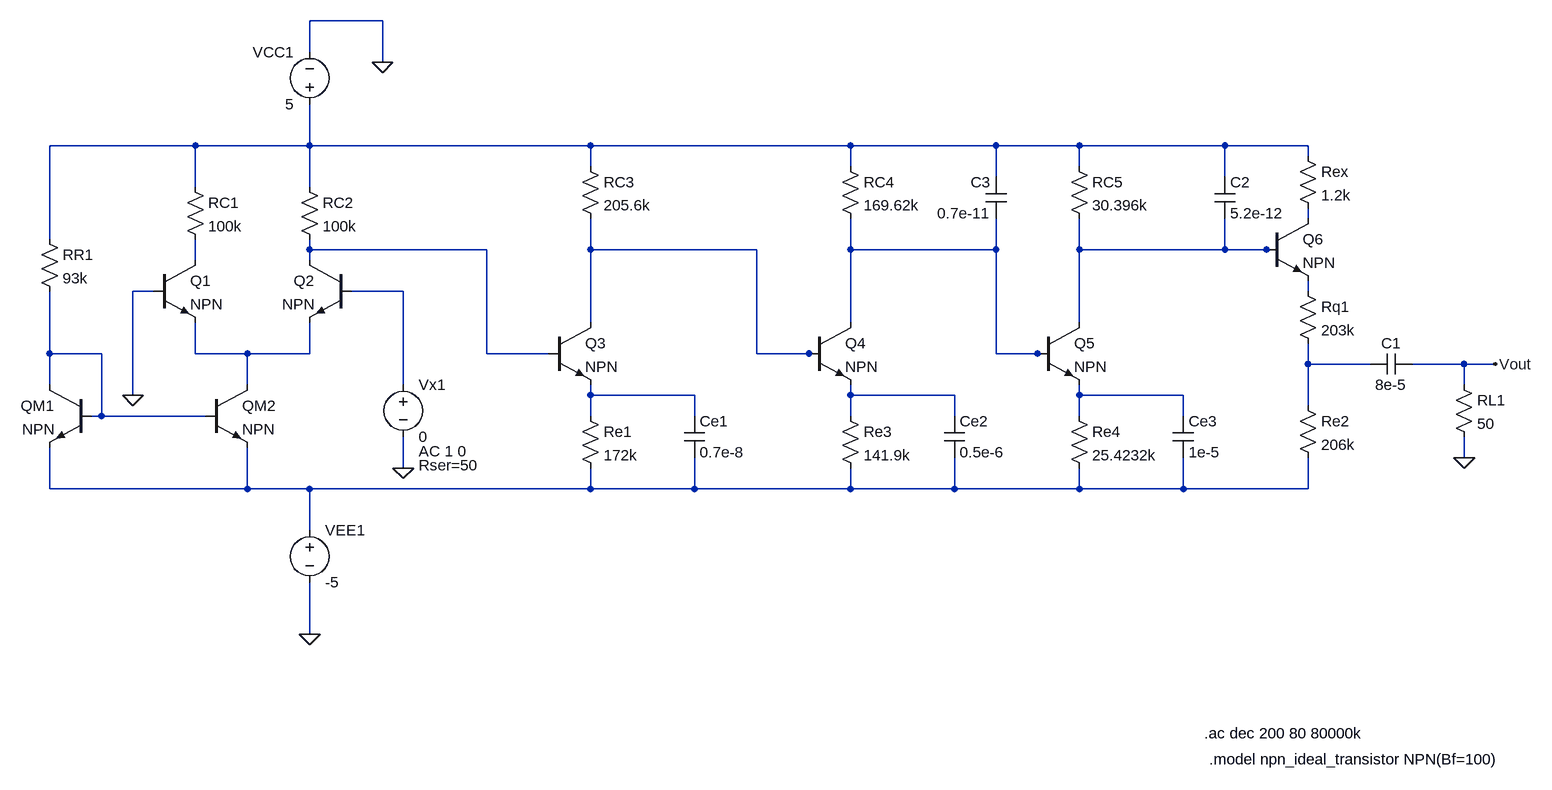
[diagram p0: schematic Frequency Response.asc]
Frequency Response.asc, the LTspice schematic file:
Version 4
SHEET 1 2228 1088
WIRE 448 -64 336 -64
WIRE 336 -16 336 -64
WIRE 448 0 448 -64
WIRE 160 128 -64 128
WIRE 336 128 336 64
WIRE 336 128 160 128
WIRE 768 128 336 128
WIRE 1168 128 768 128
WIRE 1392 128 1168 128
WIRE 1520 128 1392 128
WIRE 1744 128 1520 128
WIRE 1872 128 1744 128
WIRE 1872 144 1872 128
WIRE 768 160 768 128
WIRE 1168 160 1168 128
WIRE 1520 160 1520 128
WIRE 1392 176 1392 128
WIRE 1744 176 1744 128
WIRE 160 192 160 128
WIRE 336 192 336 128
WIRE 1872 240 1872 224
WIRE -64 272 -64 128
WIRE 336 288 336 272
WIRE 608 288 336 288
WIRE 768 288 768 240
WIRE 1024 288 768 288
WIRE 1168 288 1168 240
WIRE 1392 288 1392 240
WIRE 1392 288 1168 288
WIRE 1520 288 1520 240
WIRE 1744 288 1744 240
WIRE 1744 288 1520 288
WIRE 1808 288 1744 288
WIRE 1824 288 1808 288
WIRE 160 304 160 272
WIRE 336 304 336 288
WIRE 96 352 64 352
WIRE 480 352 400 352
WIRE 1872 352 1872 336
WIRE 768 400 768 288
WIRE 1168 400 1168 288
WIRE 1520 400 1520 288
WIRE -64 448 -64 352
WIRE 16 448 -64 448
WIRE 160 448 160 400
WIRE 240 448 160 448
WIRE 336 448 336 400
WIRE 336 448 240 448
WIRE 608 448 608 288
WIRE 704 448 608 448
WIRE 1024 448 1024 288
WIRE 1104 448 1024 448
WIRE 1120 448 1104 448
WIRE 1392 448 1392 288
WIRE 1456 448 1392 448
WIRE 1472 448 1456 448
WIRE 1872 464 1872 432
WIRE 1968 464 1872 464
WIRE 2112 464 2032 464
WIRE 2160 464 2112 464
WIRE -64 496 -64 448
WIRE 240 496 240 448
WIRE 480 496 480 352
WIRE 2112 496 2112 464
WIRE 64 512 64 352
WIRE 768 512 768 496
WIRE 928 512 768 512
WIRE 1168 512 1168 496
WIRE 1328 512 1168 512
WIRE 1520 512 1520 496
WIRE 1680 512 1520 512
WIRE 1872 528 1872 464
WIRE 16 544 16 448
WIRE 16 544 0 544
WIRE 176 544 16 544
WIRE 768 544 768 512
WIRE 928 544 928 512
WIRE 1168 544 1168 512
WIRE 1328 544 1328 512
WIRE 1520 544 1520 512
WIRE 1680 544 1680 512
WIRE 2112 608 2112 576
WIRE 480 624 480 576
WIRE -64 656 -64 592
WIRE 240 656 240 592
WIRE 240 656 -64 656
WIRE 336 656 240 656
WIRE 768 656 768 624
WIRE 768 656 336 656
WIRE 928 656 928 608
WIRE 928 656 768 656
WIRE 1168 656 1168 624
WIRE 1168 656 928 656
WIRE 1328 656 1328 608
WIRE 1328 656 1168 656
WIRE 1520 656 1520 624
WIRE 1520 656 1328 656
WIRE 1680 656 1680 608
WIRE 1680 656 1520 656
WIRE 1872 656 1872 608
WIRE 1872 656 1680 656
WIRE 336 720 336 656
WIRE 336 880 336 800
FLAG 336 880 0
FLAG 448 0 0
FLAG 480 624 0
FLAG 2112 608 0
FLAG 2160 464 Vout
FLAG 64 512 0
SYMBOL res 144 176 R0
SYMATTR InstName RC1
SYMATTR Value 100k
SYMBOL res 320 176 R0
SYMATTR InstName RC2
SYMATTR Value 100k
SYMBOL Res 752 528 R0
SYMATTR InstName Re1
SYMATTR Value 172k
SYMBOL Res -80 256 R0
SYMATTR InstName RR1
SYMATTR Value 93k
SYMBOL Res 752 144 R0
SYMATTR InstName RC3
SYMATTR Value 205.6k
SYMBOL npn 96 304 R0
SYMATTR InstName Q1
SYMBOL npn 704 400 R0
SYMATTR InstName Q3
SYMBOL npn 176 496 R0
SYMATTR InstName QM2
SYMBOL npn 0 496 M0
SYMATTR InstName QM1
SYMBOL npn 400 304 M0
SYMATTR InstName Q2
SYMBOL voltage 336 704 R0
SYMATTR InstName VEE1
SYMATTR Value -5
SYMBOL voltage 336 80 R180
WINDOW 0 24 96 Left 2
WINDOW 3 24 16 Left 2
SYMATTR InstName VCC1
SYMATTR Value 5
SYMBOL voltage 480 480 R0
WINDOW 123 24 118 Left 2
WINDOW 39 24 140 Left 2
SYMATTR Value2 AC 1 0
SYMATTR SpiceLine Rser=50
SYMATTR InstName Vx1
SYMATTR Value 0
SYMBOL cap 912 544 R0
SYMATTR InstName Ce1
SYMATTR Value 0.7e-8
SYMBOL Res 1856 512 R0
SYMATTR InstName Re2
SYMATTR Value 206k
SYMBOL Res 2096 480 R0
SYMATTR InstName RL1
SYMATTR Value 50
SYMBOL cap 2032 448 R90
WINDOW 0 0 32 VBottom 2
WINDOW 3 32 32 VTop 2
SYMATTR InstName C1
SYMATTR Value 8e-5
SYMBOL Res 1152 528 R0
SYMATTR InstName Re3
SYMATTR Value 141.9k
SYMBOL Res 1152 144 R0
SYMATTR InstName RC4
SYMATTR Value 169.62k
SYMBOL npn 1104 400 R0
SYMATTR InstName Q4
SYMBOL cap 1312 544 R0
SYMATTR InstName Ce2
SYMATTR Value 0.5e-6
SYMBOL Res 1856 336 R0
SYMATTR InstName Rq1
SYMATTR Value 203k
SYMBOL Res 1504 528 R0
SYMATTR InstName Re4
SYMATTR Value 25.4232k
SYMBOL Res 1504 144 R0
SYMATTR InstName RC5
SYMATTR Value 30.396k
SYMBOL npn 1456 400 R0
SYMATTR InstName Q5
SYMBOL cap 1664 544 R0
SYMATTR InstName Ce3
SYMATTR Value 1e-5
SYMBOL cap 1728 176 R0
SYMATTR InstName C2
SYMATTR Value 5.2e-12
SYMBOL cap 1408 240 R180
WINDOW 0 24 56 Left 2
WINDOW 3 24 8 Left 2
SYMATTR InstName C3
SYMATTR Value 0.7e-11
SYMBOL npn 1808 240 R0
SYMATTR InstName Q6
SYMBOL Res 1856 128 R0
SYMATTR InstName Rex
SYMATTR Value 1.2k
TEXT 1712 1032 Left 2 !.ac dec 200 80 80000k
TEXT 1720 1072 Left 2 !.model npn_ideal_transistor NPN(Bf=100)

The netlist it stands for:
* Frequency Response.asc
RC1 N001 N007 100k
RC2 N001 N003 100k
Re1 N013 N016 172k
RR1 N001 N010 93k
RC3 N001 N004 205.6k
Q1 N007 0 N011 0 NPN
Q3 N004 N003 N013 0 NPN
QM2 N011 N010 N016 0 NPN
QM1 N010 N010 N016 0 NPN
Q2 N003 N008 N011 0 NPN
VEE1 N016 0 -5
VCC1 N001 0 5
Vx1 N008 0 0 AC 1 0 Rser=50
Ce1 N013 N016 0.7e-8
Re2 N012 N016 206k
RL1 Vout 0 50
C1 Vout N012 8e-5
Re3 N014 N016 141.9k
RC4 N001 N005 169.62k
Q4 N005 N004 N014 0 NPN
Ce2 N014 N016 0.5e-6
Rq1 N009 N012 203k
Re4 N015 N016 25.4232k
RC5 N001 N006 30.396k
Q5 N006 N005 N015 0 NPN
Ce3 N015 N016 1e-5
C2 N001 N006 5.2e-12
C3 N005 N001 0.7e-11
Q6 N002 N006 N009 0 NPN
Rex N001 N002 1.2k
.model NPN NPN
.model PNP PNP
.lib standard.bjt
.ac dec 200 80 80000k
.model npn_ideal_transistor NPN(Bf=100)
.backanno
.end